# EAGLE design alim (EAGLE 5.11)
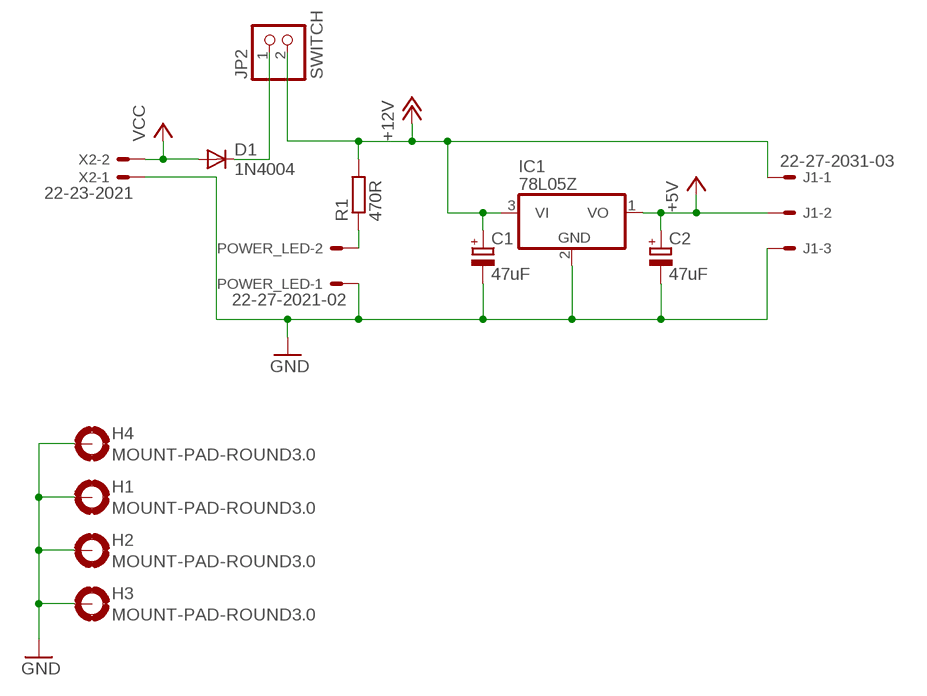
[diagram p0: schematic, sheet 1]

## Parts
C1  47uF  CPOL-EUE5-5  [E5-5]
C2  47uF  CPOL-EUE5-5  [E5-5]
D1  1N4004  [DO41-10]
H1  MOUNT-PAD-ROUND3.0  [3,0-PAD]
H2  MOUNT-PAD-ROUND3.0  [3,0-PAD]
H3  MOUNT-PAD-ROUND3.0  [3,0-PAD]
H4  MOUNT-PAD-ROUND3.0  [3,0-PAD]
IC1  78L05Z  [TO92]
J1  22-27-2031-03  [6410-03]
JP2  SWITCH  PINHD-1X2  [1X02]
POWER_LED  22-27-2021-02  [6410-02]
R1  470R  R-EU_0207/10  [0207/10]
X2  22-23-2021  [22-23-2021]

## Nets
+5V: C2.+ IC1.1(VO) J1.2
+12V: C1.+ IC1.3(VI) J1.1 JP2.2 R1.2
GND: C1.- C2.- H1.B3,0(MOUNT) H2.B3,0(MOUNT) H3.B3,0(MOUNT) H4.B3,0(MOUNT) IC1.2(GND) J1.3 POWER_LED.1 X2.1
N$1 [signal]: POWER_LED.2 R1.1
N$2: D1.C JP2.1
VCC: D1.A X2.2

## Library data of the parts
C1 C2 = rcl:CPOL-EU: POLARIZED CAPACITOR, European symbol
D1 = diode:1N4004: DIODE general purpose rectifier, 1 A
H1-H4 = holes:MOUNT-PAD-ROUND: MOUNTING PAD, round
IC1 = linear:78*: Positive VOLTAGE REGULATOR Source: http://cache.national.com/ds/LM/LM78L05.pdf http://www.fairchildsemi.com/ds/LM/LM7805.pdf
J1 = con-molex:22-?-03: CONNECTOR wire to board 2.54 mm (.1 inch) pitch header; OC_FARNELL: unknown; OC_NEWARK: unknown
JP2 = pinhead:PINHD-1X2: PIN HEADER
POWER_LED = con-molex:22-?-02: CONNECTOR wire to board 2.54 mm (.1 inch) pitch header; OC_FARNELL: unknown; OC_NEWARK: unknown
R1 = resistor:R-EU_: RESISTOR, European symbol
X2 = con-molex:22-23-2021: .100" (2.54mm) Center Header - 2 Pin; MF: MOLEX; MPN: 22-23-2021; OC_FARNELL: 1462926; OC_NEWARK: 25C3832

## Net classes
0 alim: width 1.27 mm
1 signal: width 0.813 mm

## Board
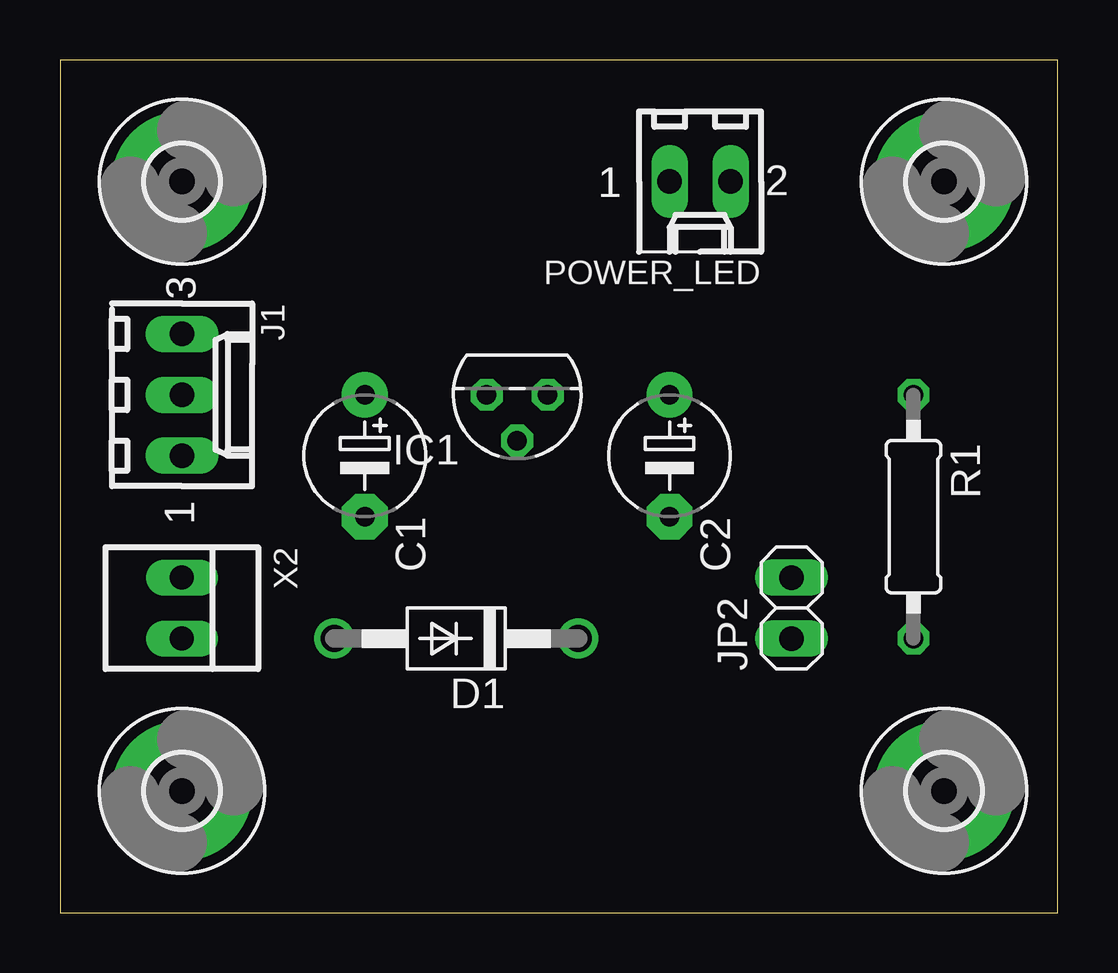
[diagram p1: board, top side]
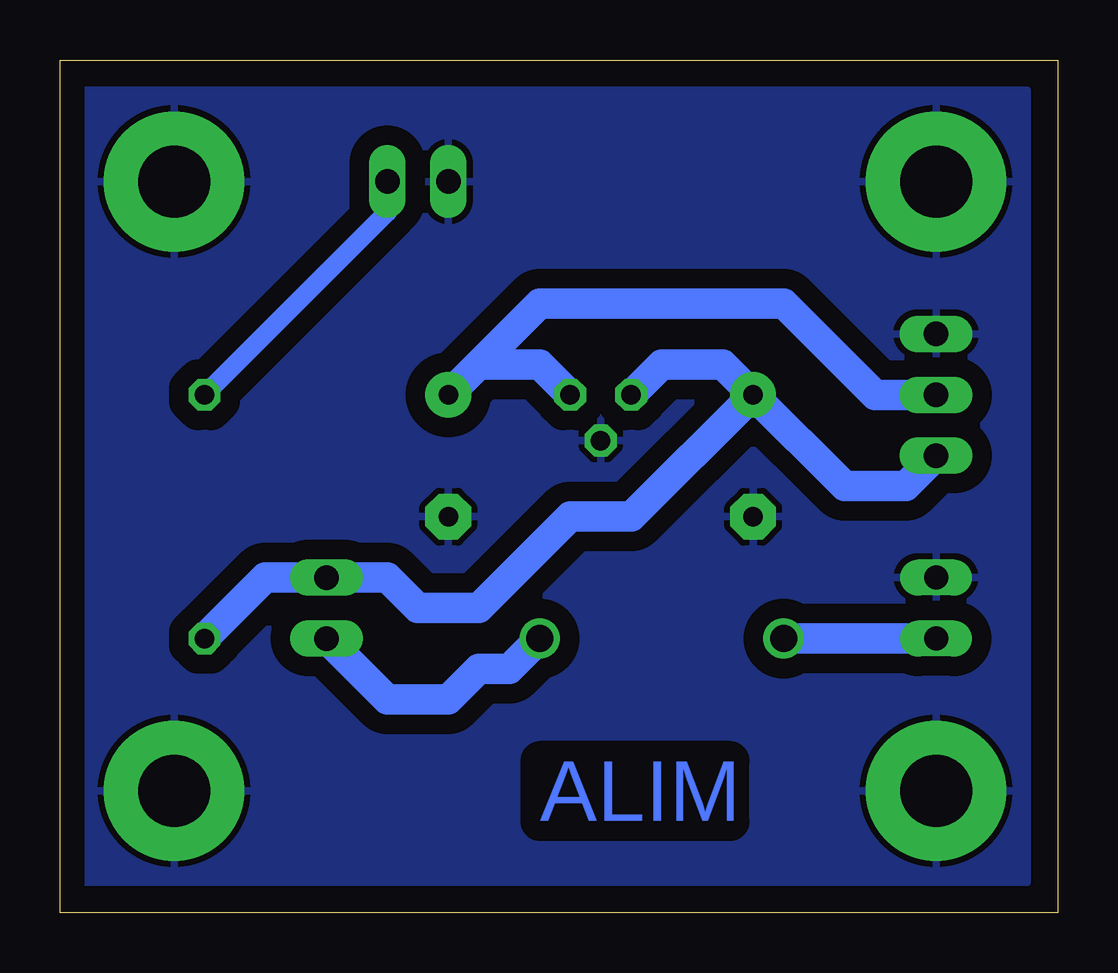
[diagram p2: board, bottom side, seen from below]

Size 41.58 x 35.55 mm. Coordinates in mm from the lower left corner, seen from the top.
Outline: 0,0 41.58,0 41.58,35.55 0,35.55 0,0
Copper layers (1*16): Top 0.035mm / dielectric 1.5mm / Bottom 0.035mm
Design rules "default *": minimum track width 10mil, minimum drill 24mil, track to track 24mil, track to pad 8mil, pad to pad 8mil, via to via 8mil, smd to smd 8mil, copper to edge 40mil, drill to drill 8mil, minimum pad ring 10mil, minimum via ring 8mil, stop-mask expansion 4mil, vias tented up to drill 0mil, thermal gap 10mil

### Footprints (pad centres in the part's own frame; a part is rotated, then mirrored left to right if it is on the bottom)
E5-5 = drill 0.813 pad 1.905 round: + -2.54,0 | drill 0.813 pad 1.905 octagon: - 2.54,0
DO41-10 = drill 1.118 round: A 5.08,0; C -5.08,0
3,0-PAD = drill 3 pad 5.842 round: B3,0 0,0
TO92 = drill 0.813 octagon: 1 -1.27,0; 2 0,1.905; 3 1.27,0
6410-03 = drill 1.016 long: 1 2.54,0; 2 0,0; 3 -2.54,0
1X02 = drill 1.016 long: 1 -1.27,0; 2 1.27,0
6410-02 = drill 1.016 long: 1 1.27,0; 2 -1.27,0
0207/10 = drill 0.813 octagon: 1 -5.08,0; 2 5.08,0
22-23-2021 = drill 1 long: 1 -1.27,0; 2 1.27,0

### Placement (x,y rotation side)
C1  12.7,19.05 270 top
C2  25.4,19.05 270 top
D1  16.51,11.43 180 top
H1  36.83,30.48 0 top
H2  5.08,30.48 0 top
H3  5.08,5.08 0 top
H4  36.83,5.08 0 top
IC1  19.05,21.59 180 top
J1  5.08,21.59 270 top
JP2  30.48,12.7 90 top
POWER_LED  26.67,30.48 180 top
R1  35.56,16.51 270 top
X2  5.08,12.7 270 top

### Tracks (layer width: path | path; a pad name or v marks a point on that pad's centre or on a via)
+5V
  Bottom 1.27: IC1.1 21.59,22.86 24.13,22.86 | 24.13,22.86 C2.+ | J1.2 7.62,21.59 11.43,25.4 21.59,25.4 24.13,22.86
+12V
  Bottom 1.27: R1.2 33.02,13.97 JP2.2 27.94,13.97 26.67,12.7 24.13,12.7 20.32,16.51 17.78,16.51 C1.+ | IC1.3 16.51,22.86 13.97,22.86 C1.+ | J1.1 6.35,17.78 8.89,17.78 C1.+
GND
  pour Bottom (isolate 0.813): 1.27,34.29 40.64,34.29 40.64,1.27 1.27,1.27
N$1
  Bottom 0.813: R1.1 27.94,29.21 POWER_LED.2
N$2
  Bottom 1.27: JP2.1 27.94,8.89 25.4,8.89 24.13,10.16 22.86,10.16 D1.C
VCC
  Bottom 1.27: X2.2 D1.A

### Text on the board
Bottom: ALIM